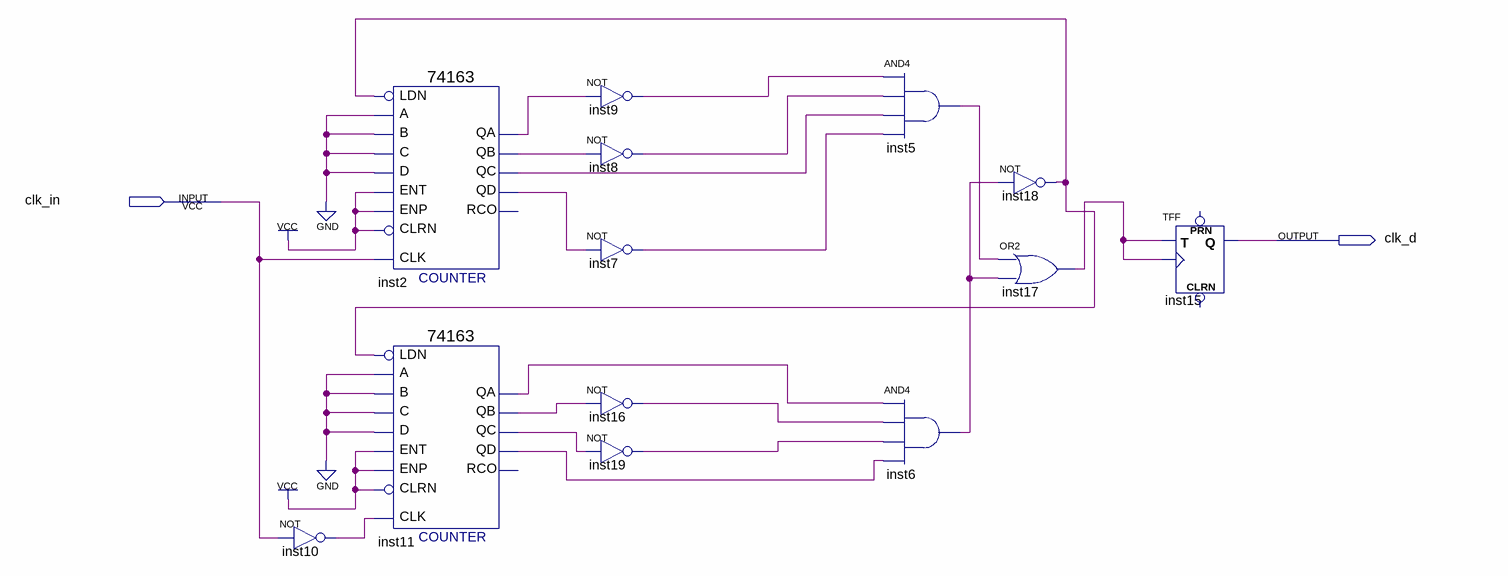
[diagram p0: schematic sheet]
// Quartus schematic Block1_2.bdf as structural Verilog: 13 symbols, 2 pins
module Block1_2 (
  input  clk_in,
  output clk_d
);

  wire inst2_qa, inst2_qb, inst2_qc, inst2_qd, inst5_out, inst6_out, inst7_out, inst8_out, inst9_out,
       inst10_out, inst11_qa, inst11_qb, inst11_qc, inst11_qd, inst16_out, inst17_out, inst18_out, inst19_out;

  not inst10 (inst10_out, clk_in);
  \74163  inst2 (
    .C(1'b0), .B(1'b0), .A(1'b0), .ENT(1'b1), .D(1'b0), .CLRN(1'b1), .CLK(clk_in), .ENP(1'b1),
    .LDN(inst18_out), .QA(inst2_qa), .QB(inst2_qb), .QC(inst2_qc), .QD(inst2_qd));  // open: RCO
  \74163  inst11 (
    .C(1'b0), .B(1'b0), .A(1'b0), .ENT(1'b1), .D(1'b0), .CLRN(1'b1), .CLK(inst10_out), .ENP(1'b1),
    .LDN(inst18_out), .QA(inst11_qa), .QB(inst11_qb), .QC(inst11_qc), .QD(inst11_qd));  // open: RCO
  not inst9 (inst9_out, inst2_qa);
  not inst8 (inst8_out, inst2_qb);
  not inst7 (inst7_out, inst2_qd);
  not inst16 (inst16_out, inst11_qb);
  not inst19 (inst19_out, inst11_qc);
  and inst5 (inst5_out, inst9_out, inst8_out, inst2_qc, inst7_out);
  and inst6 (inst6_out, inst11_qa, inst16_out, inst19_out, inst11_qd);
  not inst18 (inst18_out, inst6_out);
  or inst17 (inst17_out, inst5_out, inst6_out);
  TFF inst15 (.T(inst17_out), .CLK(inst17_out), .Q(clk_d));  // open: PRN, CLRN
endmodule
